# Altium schematic sheet Sheet1.SchDoc
size A4; SheetNumber: 1; SheetTotal: 1
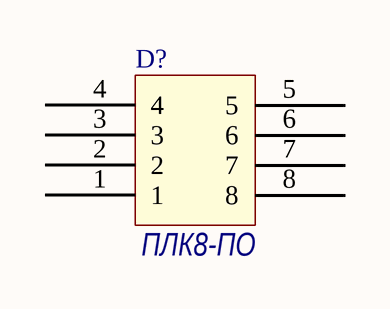
[diagram p0: Sheet1.SchDoc]

## Parts
D?  ПЛК8-ПО  [ПЛК8-ПО]

## Nets

Not connected (* = marked no-connect by the designer): D? 1 2 3 4 5 6 7 8

## Library data of the parts
D? = ПЛК8_ПО